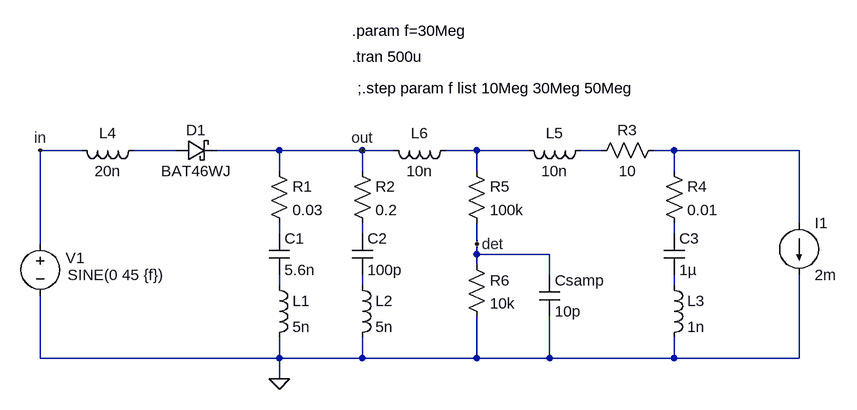
[diagram p0: schematic peak_detector_rev3.asc]
peak_detector_rev3.asc, the LTspice schematic file:
Version 4
SHEET 1 1120 680
WIRE -48 48 -112 48
WIRE 96 48 32 48
WIRE 256 48 160 48
WIRE 384 48 256 48
WIRE 432 48 384 48
WIRE 560 48 512 48
WIRE 640 48 560 48
WIRE 752 48 720 48
WIRE 864 48 832 48
WIRE 1056 48 864 48
WIRE 256 80 256 48
WIRE 384 80 384 48
WIRE 560 80 560 48
WIRE 864 80 864 48
WIRE 1056 160 1056 48
WIRE 256 176 256 160
WIRE 384 176 384 160
WIRE 864 176 864 160
WIRE -112 192 -112 48
WIRE 560 192 560 160
WIRE 560 208 560 192
WIRE 672 208 560 208
WIRE 560 224 560 208
WIRE 672 240 672 208
WIRE 256 256 256 240
WIRE 384 256 384 240
WIRE 864 256 864 240
WIRE -112 368 -112 272
WIRE 256 368 256 336
WIRE 256 368 -112 368
WIRE 384 368 384 336
WIRE 384 368 256 368
WIRE 560 368 560 304
WIRE 560 368 384 368
WIRE 672 368 672 304
WIRE 672 368 560 368
WIRE 864 368 864 336
WIRE 864 368 672 368
WIRE 1056 368 1056 240
WIRE 1056 368 864 368
WIRE 256 400 256 368
FLAG 384 48 out
FLAG -112 48 in
FLAG 560 192 det
FLAG 256 400 0
SYMBOL cap 240 176 R0
SYMATTR InstName C1
SYMATTR Value 5.6n
SYMBOL ind 240 240 R0
SYMATTR InstName L1
SYMATTR Value 5n
SYMBOL res 240 64 R0
SYMATTR InstName R1
SYMATTR Value 0.03
SYMBOL schottky 96 64 R270
WINDOW 0 32 32 VTop 2
WINDOW 3 0 32 VBottom 2
SYMATTR InstName D1
SYMATTR Value BAT46WJ
SYMATTR Description Diode
SYMATTR Type diode
SYMBOL cap 368 176 R0
SYMATTR InstName C2
SYMATTR Value 100p
SYMBOL ind 368 240 R0
SYMATTR InstName L2
SYMATTR Value 5n
SYMBOL res 368 64 R0
SYMATTR InstName R2
SYMATTR Value 0.2
SYMBOL voltage -112 176 R0
WINDOW 3 42 64 Left 2
WINDOW 123 24 124 Left 2
WINDOW 39 0 0 Left 0
WINDOW 0 39 38 Left 2
SYMATTR Value SINE(0 45 {f})
SYMATTR InstName V1
SYMBOL current 1056 160 R0
WINDOW 123 0 0 Left 0
WINDOW 39 0 0 Left 0
SYMATTR InstName I1
SYMATTR Value 2m
SYMBOL res 848 32 R90
WINDOW 0 0 56 VBottom 2
WINDOW 3 32 56 VTop 2
SYMATTR InstName R3
SYMATTR Value 10
SYMBOL cap 848 176 R0
SYMATTR InstName C3
SYMATTR Value 1µ
SYMBOL ind 848 240 R0
SYMATTR InstName L3
SYMATTR Value 1n
SYMBOL res 848 64 R0
SYMATTR InstName R4
SYMATTR Value 0.01
SYMBOL ind 48 32 R90
WINDOW 0 5 56 VBottom 2
WINDOW 3 32 56 VTop 2
SYMATTR InstName L4
SYMATTR Value 20n
SYMBOL ind 736 32 R90
WINDOW 0 5 56 VBottom 2
WINDOW 3 32 56 VTop 2
SYMATTR InstName L5
SYMATTR Value 10n
SYMBOL res 544 64 R0
SYMATTR InstName R5
SYMATTR Value 100k
SYMBOL res 544 208 R0
SYMATTR InstName R6
SYMATTR Value 10k
SYMBOL ind 528 32 R90
WINDOW 0 5 56 VBottom 2
WINDOW 3 32 56 VTop 2
SYMATTR InstName L6
SYMATTR Value 10n
SYMBOL cap 656 240 R0
SYMATTR InstName Csamp
SYMATTR Value 10p
TEXT 368 -136 Left 2 !.param f=30Meg
TEXT 368 -96 Left 2 !.tran 500u
TEXT 376 -48 Left 2 !;.step param f list 10Meg 30Meg 50Meg

The netlist it stands for:
* peak_detector_rev3.asc
C1 N005 N008 5.6n
L1 N008 0 5n
R1 out N005 0.03
D1 N001 out BAT46WJ
C2 N006 N009 100p
L2 N009 0 5n
R2 out N006 0.2
V1 in 0 SINE(0 45 {f})
I1 N004 0 2m
R3 N004 N003 10
C3 N007 N010 1µ
L3 N010 0 1n
R4 N004 N007 0.01
L4 N001 in 20n
L5 N003 N002 10n
R5 N002 det 100k
R6 det 0 10k
L6 N002 out 10n
Csamp det 0 10p
.model D D
.lib standard.dio
.param f=30Meg
.tran 500u
;.step param f list 10Meg 30Meg 50Meg
.backanno
.end